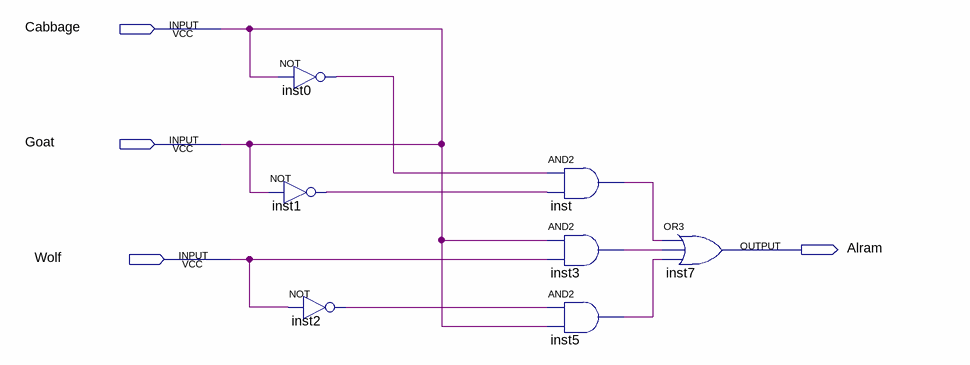
[diagram p0: schematic sheet]
// Quartus schematic lab3step0.bdf as structural Verilog: 7 symbols, 4 pins
module lab3step0 (
  input  Cabbage,
  input  Goat,
  input  Wolf,
  output Alram
);

  wire inst0_out, inst1_out, inst2_out, inst3_out, inst5_out, inst_out;

  not inst0 (inst0_out, Cabbage);
  not inst1 (inst1_out, Cabbage);
  not inst2 (inst2_out, Wolf);
  and inst (inst_out, inst0_out, inst1_out);
  and inst3 (inst3_out, Cabbage, Wolf);
  and inst5 (inst5_out, inst2_out, Cabbage);
  or inst7 (Alram, inst_out, inst3_out, inst5_out);

  assign Goat = Cabbage;
endmodule
